# EAGLE design SNES_RGBAmp (EAGLE 7.0.0)
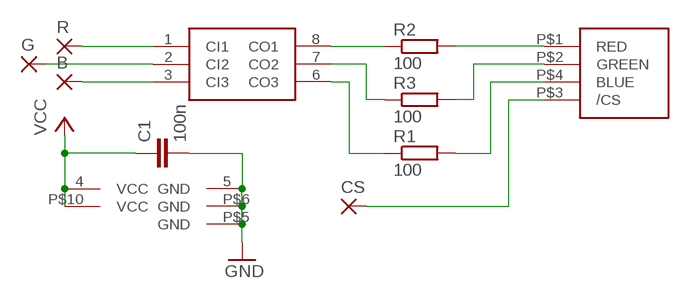
[diagram p0: schematic, sheet 1]

## Parts
B  SMD2  [SMD1,27-2,54]
C1  100n  C0805  [Z0805]
CS  SMD2  [SMD1,27-2,54]
G  SMD2  [SMD1,27-2,54]
R  SMD2  [SMD1,27-2,54]
R1  100  R0805  [Z0805]
R2  100  R0805  [Z0805]
R3  100  R0805  [Z0805]
U$1  THS7314  [THS7314]
U$3  SNES_MULTIAV_RGBC_ONLY  [SNES_MULTIAV_RGBC_ONLY]

## Nets
GND: C1.2 U$1.5(GND) U$3.P$5(GND) U$3.P$6(GND)
N$1: R.1(P) U$1.1(CI1)
N$2: G.1(P) U$1.2(CI2)
N$3: B.1(P) U$1.3(CI3)
N$4: R2.1 U$1.8(CO1)
N$5: R2.2 U$3.P$1(RED)
N$6: R3.2 U$3.P$2(GREEN)
N$7: R3.1 U$1.7(CO2)
N$8: R1.1 U$1.6(CO3)
N$9: R1.2 U$3.P$4(BLUE)
N$10: CS.1(P) U$3.P$3(/CS)
VCC: C1.1 U$1.4(VCC) U$3.P$10(VCC)

## Library data of the parts
B CS G R = wirepad:SMD2: SMD PAD
C1 = snescart:C0805
R1-R3 = snescart:R0805
U$1 = snescart:THS7314
U$3 = snes_div:SNES_MULTIAV_RGBC_ONLY

## Board
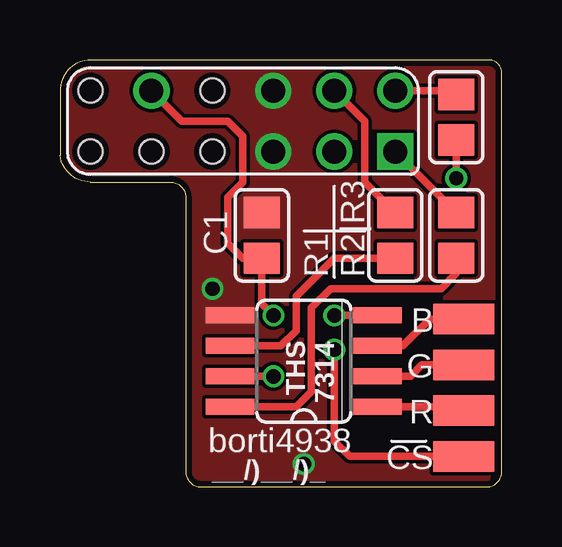
[diagram p1: board, top side]
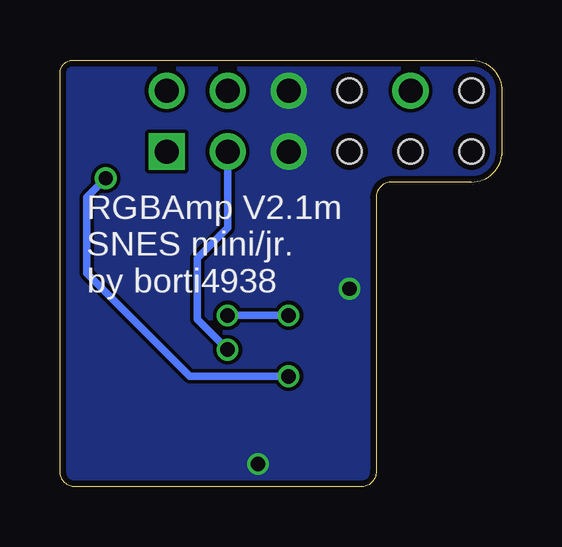
[diagram p2: board, bottom side, seen from below]

Size 18.41 x 17.79 mm. Coordinates in mm from the lower left corner, seen from the top.
Outline: 1.27,12.7 4.6,12.7 arc-90 5.24,12.07 5.24,0.64 arc90 5.87,0 17.78,0 arc90 18.41,0.64 18.41,17.3 arc90 17.78,17.78 1.27,17.78 arc90 0,16.51 0,13.81 arc82 1.27,12.7
Copper layers (1*16): Top 0.035mm / dielectric 1.5mm / Bottom 0.035mm
Design rules "ITEADstudio_DRC": minimum track width 6mil, minimum drill 12mil, track to track 6mil, track to pad 6mil, pad to pad 6mil, via to via 6mil, smd to smd 0mil, copper to edge 10mil, drill to drill 10mil, minimum pad ring 10mil, minimum via ring 6mil, stop-mask expansion 2mil, vias tented up to drill 100mil, thermal gap 10mil

### Footprints (pad centres in the part's own frame; a part is rotated, then mirrored left to right if it is on the bottom)
SMD1,27-2,54 = smd 1.27 x 2.54: 1 0,0
Z0805 = smd 1.3 x 1.5: 1 -0.95,0; 2 0.95,0
THS7314 = smd 0.66 x 2.032: 1 -1.905,-3.073; 2 -0.635,-3.073; 3 0.635,-3.073; 4 1.905,-3.073; 5 1.905,3.073; 6 0.635,3.073; 7 -0.635,3.073; 8 -1.905,3.073
SNES_MULTIAV_RGBC_ONLY = drill 1 square: P$1 6.35,-1.27 | drill 1: P$2 6.35,1.27; P$3 3.81,-1.27; P$4 3.81,1.27; P$5 1.27,-1.27; P$6 1.27,1.27; P$10 -3.81,1.27 | hole 1: -1.27,-1.27; -1.27,1.27; -3.81,-1.27; -6.35,-1.27; -6.35,1.27

### Placement (x,y rotation side)
B  16.83,6.99 90 top
C1  8.41,10.48 90 top
CS  16.83,1.27 90 top
G  16.83,5.08 90 top
R  16.83,3.17 90 top
R1  13.97,10.48 90 top
R2  16.51,10.48 90 top
R3  16.51,15.4 90 top
U$1  10.16,5.24 90 top
U$3  7.62,15.24 0 top

### Tracks (layer width: path | path; a pad name or v marks a point on that pad's centre or on a via)
GND  (via drill 0.6)
  other vias: 6.35,8.25 10.16,0.95
  pour Top (no thermals): -2.54,-3.17 21.59,-3.17 21.59,19.68 -2.54,19.68
  pour Bottom (no thermals): -2.54,19.68 21.59,19.68 21.59,-3.17 -2.54,-3.17
N$1
  Top 0.305: U$1.1 16.67,3.33 R.1
N$2
  Top 0.305: G.1 15.08,5.08 14.61,4.6 U$1.2
N$3
  Top 0.305: U$1.3 14.29,5.87 15.4,6.99 B.1
N$4
  Top 0.305: U$1.8 9.84,3.33 10.48,3.97 10.48,7.46 11.27,8.25 15.88,8.25 16.51,8.89 R2.1
N$5
  Top 0.305: U$3.P$1 R2.2
N$6
  Top 0.305: 16.51,16.51 R3.2 16.35,16.51 U$3.P$2
N$7  (via drill 0.6)
  Top 0.305: U$1.7 v8.89,4.6 | v16.51,12.86 R3.1
  Bottom 0.305: v16.51,12.86 17.3,12.07 17.3,8.89 13.02,4.6 v8.89,4.6
N$8
  Top 0.305: U$1.6 9.21,5.87 9.84,6.51 9.84,7.94 11.43,9.52 R1.1
N$9
  Top 0.305: R1.2 12.7,12.7 12.7,15.24 U$3.P$4
N$10  (via drill 0.6)
  Top 0.305: CS.1 12.07,1.27 11.43,1.91 v11.43,5.72
  Bottom 0.305: v11.43,5.72 12.7,6.99 12.7,9.52 11.43,10.8 U$3.P$3
VCC  (via drill 0.6)
  Top 0.305: U$1.4 v11.43,7.14 | v8.89,7.14 8.41,7.62 C1.1 7.62,9.53 6.99,10.16 6.99,12.07 7.62,12.7 7.62,14.61 6.99,15.24 5.08,15.24 U$3.P$10
  Bottom 0.305: v8.89,7.14 v11.43,7.14

### Text on the board
tPlace: C1 | THS / 7314 | borti4938 | __/)__/)_
bPlace: RGBAmp V2.1m / SNES mini/jr. / by borti4938
tNames: R1 / R2|R3